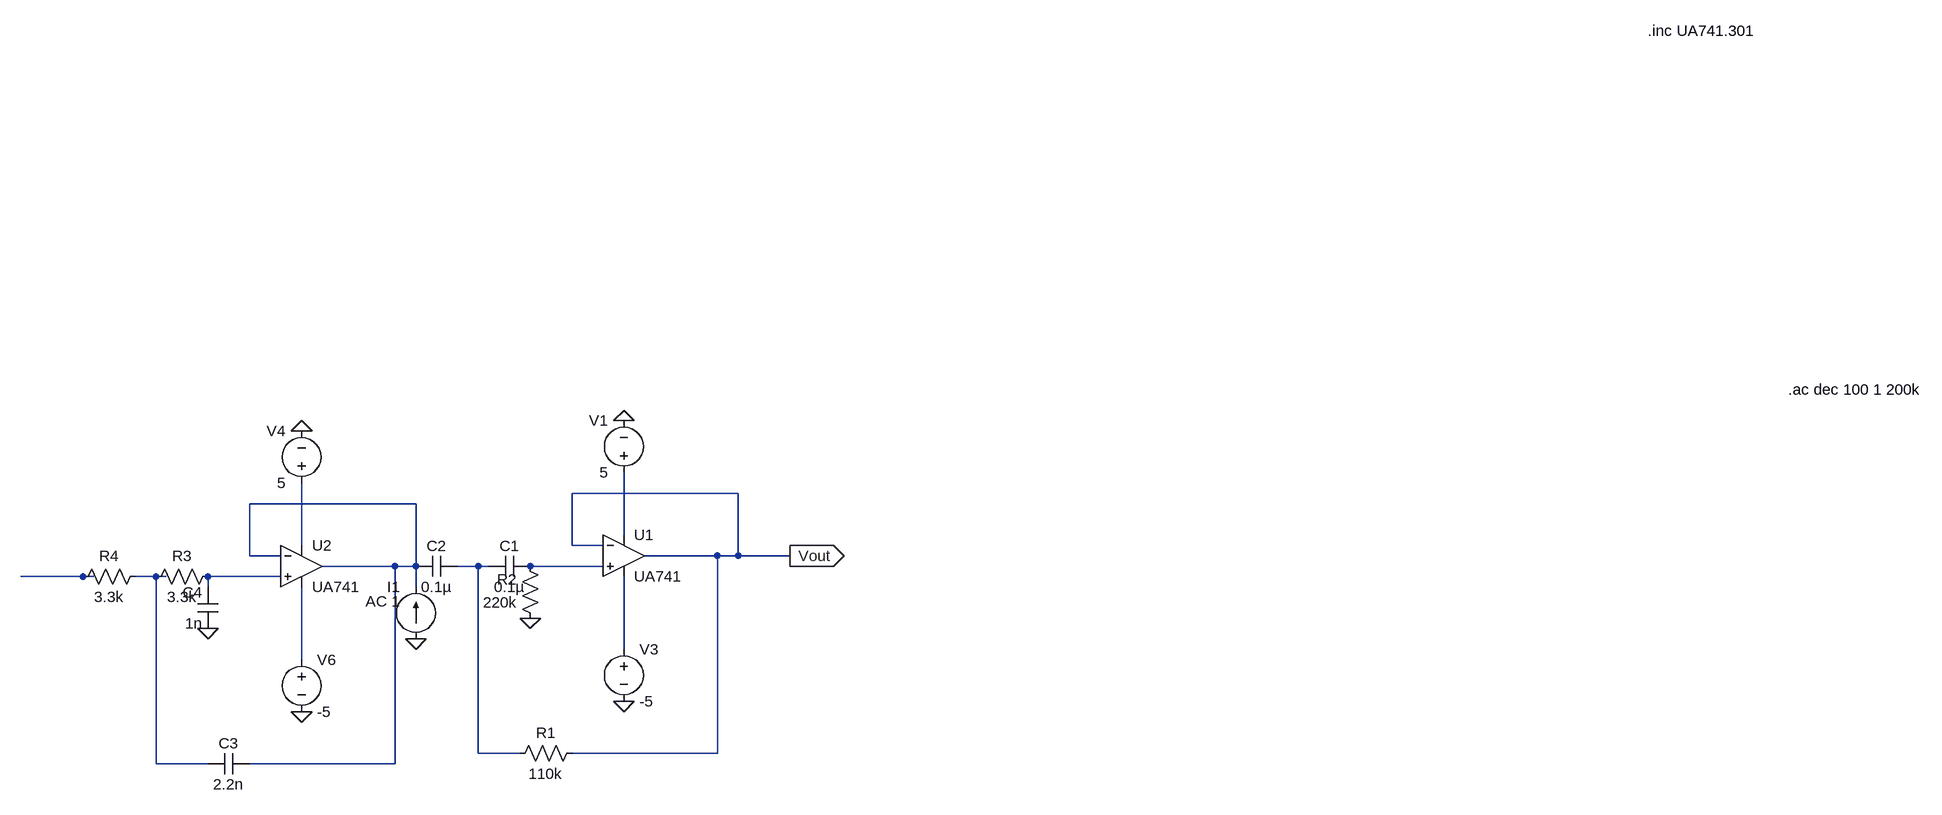
[diagram p0: schematic Audio_Filter_Sallen_Key.asc]
Audio_Filter_Sallen_Key.asc, the LTspice schematic file:
Version 4
SHEET 1 1672 1144
WIRE -160 688 -416 688
WIRE -656 704 -912 704
WIRE -336 752 -336 656
WIRE -832 768 -832 672
WIRE -416 768 -416 688
WIRE -368 768 -416 768
WIRE -912 784 -912 704
WIRE -864 784 -912 784
WIRE -192 784 -304 784
WIRE -160 784 -160 688
WIRE -160 784 -192 784
WIRE -80 784 -160 784
WIRE -688 800 -800 800
WIRE -656 800 -656 704
WIRE -656 800 -688 800
WIRE -560 800 -592 800
WIRE -544 800 -560 800
WIRE -368 800 -480 800
WIRE -1168 816 -1264 816
WIRE -1152 816 -1168 816
WIRE -1056 816 -1088 816
WIRE -1040 816 -1056 816
WIRE -864 816 -976 816
WIRE -976 832 -976 816
WIRE -656 832 -656 800
WIRE -336 928 -336 816
WIRE -832 944 -832 832
WIRE -560 1088 -560 800
WIRE -496 1088 -560 1088
WIRE -192 1088 -192 784
WIRE -192 1088 -416 1088
WIRE -1056 1104 -1056 816
WIRE -976 1104 -1056 1104
WIRE -688 1104 -688 800
WIRE -688 1104 -912 1104
FLAG -336 576 0
FLAG -336 1008 0
FLAG -480 880 0
FLAG -656 912 0
FLAG -832 592 0
FLAG -832 1024 0
FLAG -976 896 0
FLAG -80 784 Vout
IOPIN -80 784 Out
SYMBOL opamp2 -336 720 R0
SYMATTR InstName U1
SYMATTR Value UA741
SYMBOL voltage -336 672 R180
WINDOW 0 24 96 Left 2
WINDOW 3 24 16 Left 2
WINDOW 123 0 0 Left 0
WINDOW 39 0 0 Left 0
SYMATTR InstName V1
SYMATTR Value 5
SYMBOL voltage -336 912 R0
WINDOW 123 0 0 Left 0
WINDOW 39 0 0 Left 0
SYMATTR InstName V3
SYMATTR Value -5
SYMBOL res -400 1072 R90
WINDOW 0 0 56 VBottom 2
WINDOW 3 32 56 VTop 2
SYMATTR InstName R1
SYMATTR Value 110k
SYMBOL res -464 896 R180
WINDOW 0 36 76 Left 2
WINDOW 3 36 40 Left 2
SYMATTR InstName R2
SYMATTR Value 220k
SYMBOL cap -480 784 R90
WINDOW 0 0 32 VBottom 2
WINDOW 3 32 32 VTop 2
SYMATTR InstName C1
SYMATTR Value 0.1µ
SYMBOL cap -592 784 R90
WINDOW 0 0 32 VBottom 2
WINDOW 3 32 32 VTop 2
SYMATTR InstName C2
SYMATTR Value 0.1µ
SYMBOL opamp2 -832 736 R0
SYMATTR InstName U2
SYMATTR Value UA741
SYMBOL voltage -832 688 R180
WINDOW 0 24 96 Left 2
WINDOW 3 24 16 Left 2
WINDOW 123 0 0 Left 0
WINDOW 39 0 0 Left 0
SYMATTR InstName V4
SYMATTR Value 5
SYMBOL voltage -832 928 R0
WINDOW 123 0 0 Left 0
WINDOW 39 0 0 Left 0
SYMATTR InstName V6
SYMATTR Value -5
SYMBOL cap -912 1088 R90
WINDOW 0 0 32 VBottom 2
WINDOW 3 32 32 VTop 2
SYMATTR InstName C3
SYMATTR Value 2.2n
SYMBOL cap -960 896 R180
WINDOW 0 24 56 Left 2
WINDOW 3 24 8 Left 2
SYMATTR InstName C4
SYMATTR Value 1n
SYMBOL res -960 800 R90
WINDOW 0 0 56 VBottom 2
WINDOW 3 32 56 VTop 2
SYMATTR InstName R3
SYMATTR Value 3.3k
SYMBOL res -1072 800 R90
WINDOW 0 0 56 VBottom 2
WINDOW 3 32 56 VTop 2
SYMATTR InstName R4
SYMATTR Value 3.3k
SYMBOL current -656 912 R180
WINDOW 0 24 80 Left 2
WINDOW 3 24 0 Left 2
WINDOW 123 24 58 Left 2
SYMATTR InstName I1
SYMATTR Value ""
SYMATTR Value2 AC 1
TEXT 1240 -24 Left 2 !.inc UA741.301
TEXT 1456 528 Left 2 !.ac dec 100 1 200k

The netlist it stands for:
* Audio_Filter_Sallen_Key.asc
XU1 N005 Vout N002 N009 Vout UA741  ; pins In+ In- V+ V- OUT
V1 N002 0 5
V3 N009 0 -5
R1 Vout N004 110k
R2 0 N005 220k
C1 N005 N004 0.1µ
C2 N004 N001 0.1µ
XU2 N008 N001 N003 N010 N001 UA741  ; pins In+ In- V+ V- OUT
V4 N003 0 5
V6 N010 0 -5
C3 N001 N007 2.2n
C4 0 N008 1n
R3 N008 N007 3.3k
R4 N007 N006 3.3k
I1 0 N001 AC 1
.inc UA741.301
.ac dec 100 1 200k
.backanno
.end